# Altium schematic sheet Esquematico.SchDoc
size A4
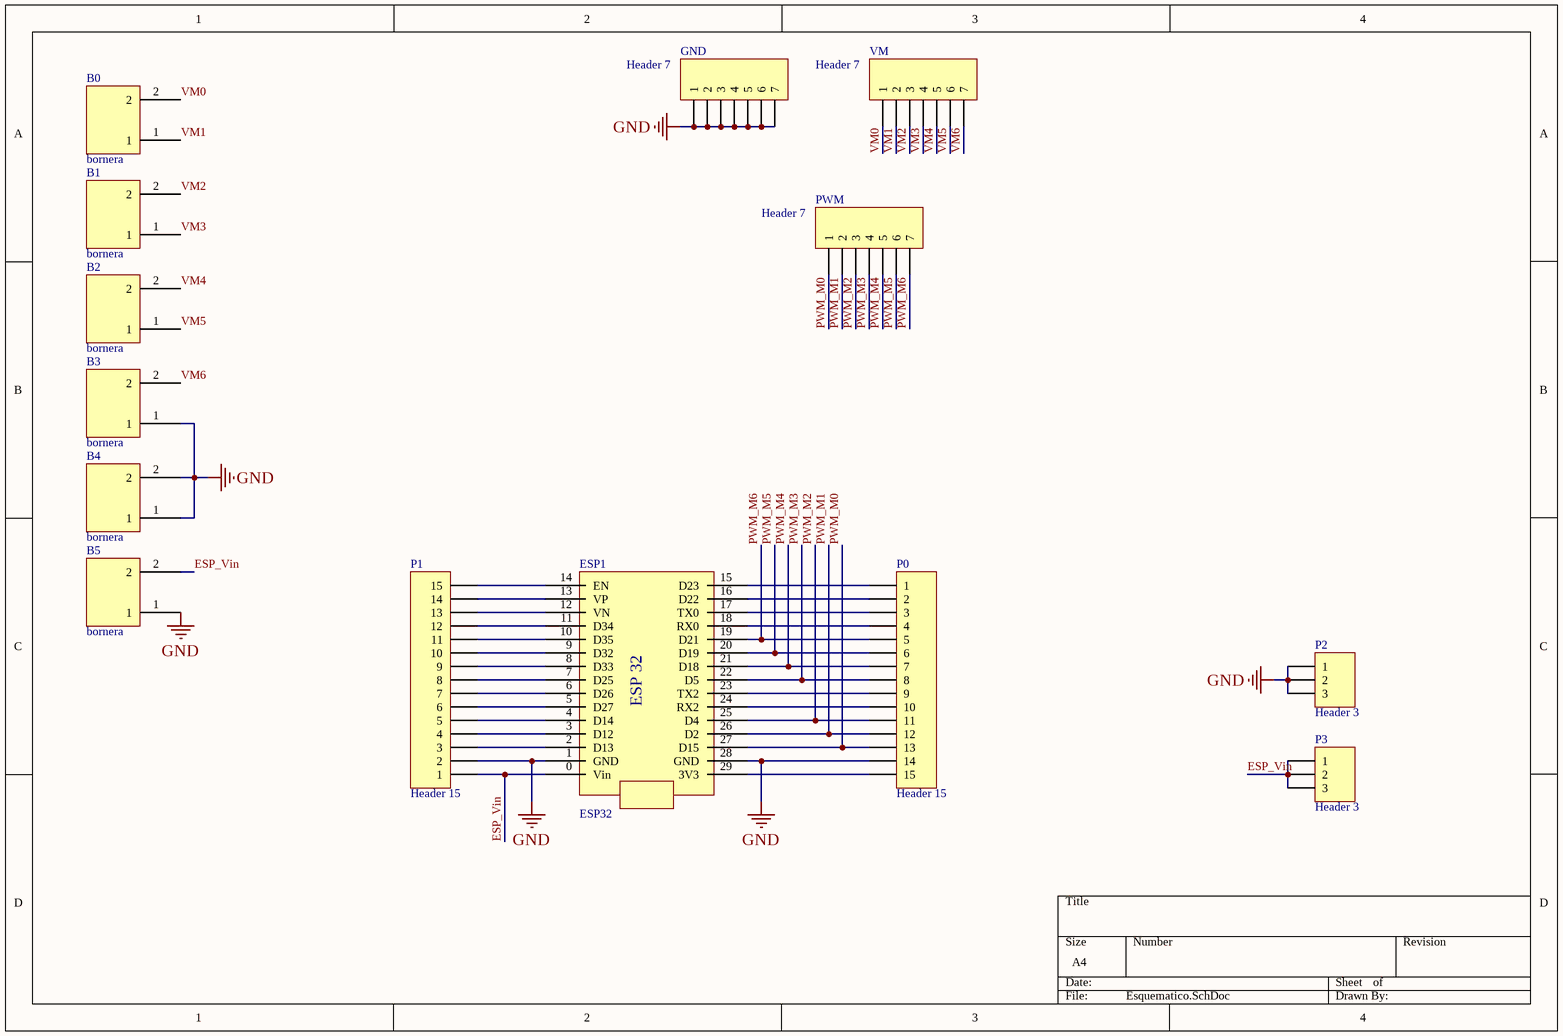
[diagram p0: Esquematico.SchDoc]

## Parts
B0  bornera  [bornera chica]
B1  bornera  [bornera chica]
B2  bornera  [bornera chica]
B3  bornera  [bornera chica]
B4  bornera  [bornera chica]
B5  bornera  [bornera chica]
ESP1  ESP32  [ESP32]
GND  Header 7  [Header 7]
P0  Header 15  [HDR1X15]
P1  Header 15  [HDR1X15]
P2  Header 3  [Header 3]
P3  Header 3  [Header 3]
PWM  Header 7  [Header 7]
VM  Header 7  [Header 7]

## Nets
GND: B3.1 B4.1 B4.2 B5.1 ESP1.1(GND) ESP1.28(GND) GND.1 GND.2 GND.3 GND.4 GND.5 GND.6 GND.7 P0.14 P1.2 P2.1 P2.2 P2.3
ESP_Vin: B5.2 ESP1.0(Vin) P1.1 P3.1 P3.2 P3.3
PWM_M0: ESP1.27(D15) P0.13 PWM.1
PWM_M1: ESP1.26(D2) P0.12 PWM.2
PWM_M2: ESP1.25(D4) P0.11 PWM.3
PWM_M3: ESP1.22(D5) P0.8 PWM.4
PWM_M4: ESP1.21(D18) P0.7 PWM.5
PWM_M5: ESP1.20(D19) P0.6 PWM.6
PWM_M6: ESP1.19(D21) P0.5 PWM.7
VM0: B0.2 VM.1
VM1: B0.1 VM.2
VM2: B1.2 VM.3
VM3: B1.1 VM.4
VM4: B2.2 VM.5
VM5: B2.1 VM.6
VM6: B3.2 VM.7
NetESP1_2: ESP1.2(D13) P1.3
NetESP1_3: ESP1.3(D12) P1.4
NetESP1_4: ESP1.4(D14) P1.5
NetESP1_5: ESP1.5(D27) P1.6
NetESP1_6: ESP1.6(D26) P1.7
NetESP1_7: ESP1.7(D25) P1.8
NetESP1_8: ESP1.8(D33) P1.9
NetESP1_9: ESP1.9(D32) P1.10
NetESP1_10: ESP1.10(D35) P1.11
NetESP1_11: ESP1.11(D34) P1.12
NetESP1_12: ESP1.12(VN) P1.13
NetESP1_13: ESP1.13(VP) P1.14
NetESP1_14: ESP1.14(EN) P1.15
NetESP1_15: ESP1.15(D23) P0.1
NetESP1_16: ESP1.16(D22) P0.2
NetESP1_17: ESP1.17(TX0) P0.3
NetESP1_18: ESP1.18(RX0) P0.4
NetESP1_23: ESP1.23(TX2) P0.9
NetESP1_24: ESP1.24(RX2) P0.10
NetESP1_29: ESP1.29(3V3) P0.15

## Notes on the sheet
- (in symbol ESP32) ESP 32

## Library data of the parts
GND PWM VM = Header 7: Header, 7-Pin; LatestRevisionDate: 17-Jul-2002; LatestRevisionNote: Re-released for DXP Platform.; Publisher: Altium Limited
P0 P1 = Header 15: Header, 15-Pin; LatestRevisionDate: 17-Jul-2002; LatestRevisionNote: Re-released for DXP Platform.; Publisher: Altium Limited
P2 P3 = Header 3: Header, 3-Pin; LatestRevisionDate: 17-Jul-2002; LatestRevisionNote: Re-released for DXP Platform.; Publisher: Altium Limited